# EAGLE design SDR-RPI Shield 3.0 (EAGLE 8.1.1)
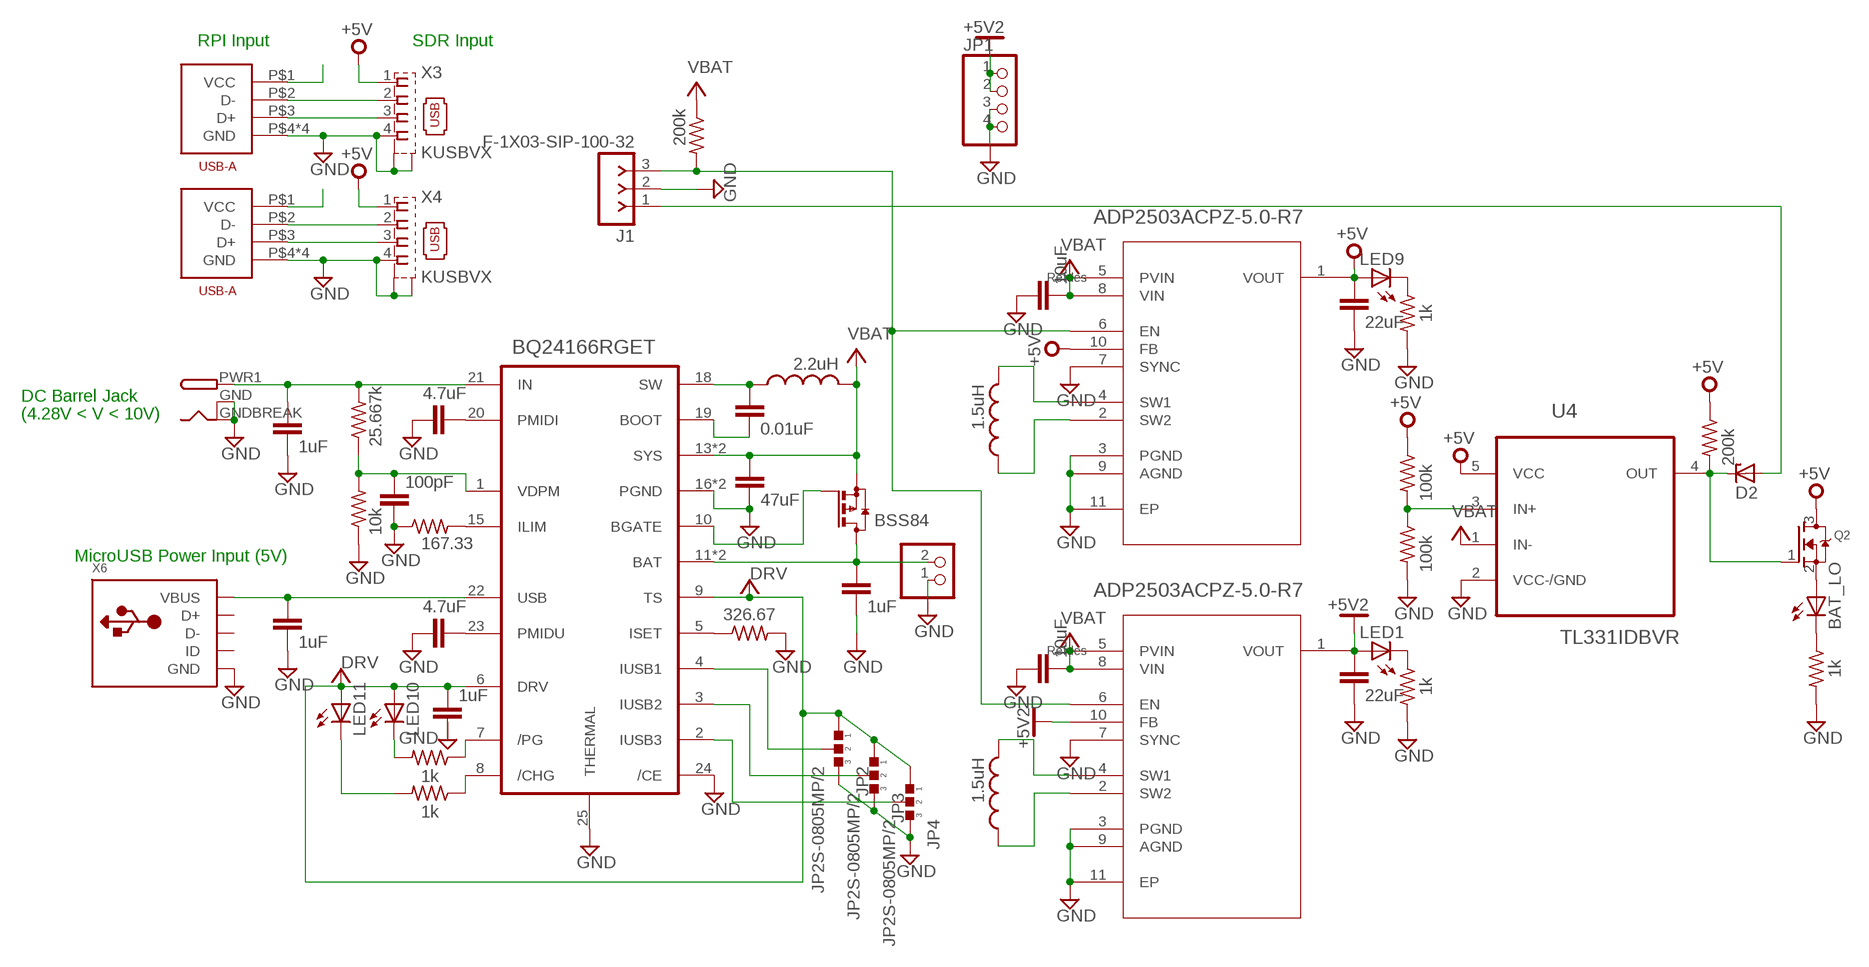
[diagram p0: schematic, sheet 1]

## Parts
BAT_LO  LED_ESML0603  [LED_SML0603]
C1  1uF  C-EUC0805  [C0805]
C2  4.7uF  C-EUC0805  [C0805]
C3  1uF  C-EUC0805  [C0805]
C4  4.7uF  C-EUC0805  [C0805]
C5  1uF  C-EUC0805  [C0805]
C6  0.01uF  C-EUC0805  [C0805]
C7  22uF  C-EUC0805  [C0805]
C8  1uF  C-EUC0805  [C0805]
C9  47uF  C-EUC0805  [C0805]
C10  10uF  C-EUC0805  [C0805]
C11  10uF  C-EUC0805  [C0805]
C12  22uF  C-EUC0805  [C0805]
C17  100pF  C-EUC0805  [C0805]
CN1  JST_2PIN-SMT  [JST-PH-2-SMT]
CN3  DCBARRELSMT  [DCJACK_2MM_SMT]
D2  ZENER-DIODESOD80C  [SOD80C]
J1  F-1X03-SIP-100-32  [SIP-100-03-32]
JP1  PINHD-1X4  [1X04]
JP2  JP2S-0805MP/2  [R0805MP/2]
JP3  JP2S-0805MP/2  [R0805MP/2]
JP4  JP2S-0805MP/2  [R0805MP/2]
L1  2.2uH  L-USL1812  [L1812]
L2  1.5uH  L-USL1812  [L1812]
L3  1.5uH  L-USL1812  [L1812]
LED1  LED_ESML0603  [LED_SML0603]
LED9  LED_ESML0603  [LED_SML0603]
LED10  LED_ESML0603  [LED_SML0603]
LED11  LED_ESML0603  [LED_SML0603]
Q1  BSS84  [SOT23]
Q2  MOSFET-NREFLOW  [SOT23]
R1  25.667k  R-US_M0805  [M0805]
R2  10k  R-US_M0805  [M0805]
R3  167.33  R-US_M0805  [M0805]
R4  1k  R-US_M0805  [M0805]
R5  1k  R-US_M0805  [M0805]
R6  326.67  R-US_M0805  [M0805]
R7  1k  R-US_M0805  [M0805]
R8  1k  R-US_M0805  [M0805]
R9  100k  R-US_M0805  [M0805]
R10  100k  R-US_M0805  [M0805]
R11  200k  R-US_M0805  [M0805]
R12  1k  R-US_M0805  [M0805]
R16  200k  R-US_M0805  [M0805]
U1  BQ24166RGET  [QFN50P400X400X100-25N]
U2  ADP2503ACPZ-5.0-R7  [DFN300X300X80-11N]
U3  ADP2503ACPZ-5.0-R7  [DFN300X300X80-11N]
U4  TL331IDBVR  [SOT95P280X145-5N]
U$1  USB-A  [USB-A]
U$2  USB-A  [USB-A]
X3  KUSBVX  [KUSBVX]
X4  KUSBVX  [KUSBVX]
X6  USB_MICRO_20329_V2  [4UCONN_20329_V2]

## Nets
+5V: C12.1 LED9.A Q2.3(D) R9.1 R11.1 U3.1(VOUT) U3.10(FB) U4.5(VCC) X3.1 X4.1
+5V2: C7.1 JP1.1 JP1.2 LED1.A U2.1(VOUT) U2.10(FB)
DRV: C5.1 JP2.1 JP3.1 JP4.1 LED10.A LED11.A U1.6(DRV) U1.9(TS)
GND: C1.2 C2.2 C3.2 C4.2 C5.2 C7.2 C8.2 C9.2 C10.1 C11.1 C12.2 C17.2 CN1.1 CN3.GND(GNDBREAK) CN3.GNDBREAK(GND) J1.2 JP1.3 JP1.4 JP2.3 JP3.3 JP4.3 R2.1 R3.1 R6.2 R7.2 R8.2 R10.2 R12.2 U1.16(PGND) U1.17(PGND) U1.24(/CE) U1.25(THERMAL) U2.3(PGND) U2.7(SYNC) U2.9(AGND) U2.11(EP) U3.3(PGND) U3.7(SYNC) U3.9(AGND) U3.11(EP) U4.2(VCC-/GND) U$1.P$4(GND) U$1.P$5(GND) U$1.P$6(GND) U$1.P$8(GND) U$2.P$4(GND) U$2.P$5(GND) U$2.P$6(GND) U$2.P$8(GND) X3.4 X3.M1(S1) X3.M2(S2) X4.4 X4.M1(S1) X4.M2(S2) X6.BASE@1(GND) X6.BASE@2(GND) X6.GND X6.SPRT@1(GND) X6.SPRT@2(GND) X6.SPRT@3(GND) X6.SPRT@4(GND)
N$1: C17.1 R1.1 R2.2 U1.1(VDPM)
N$2: R4.1 U1.7(/PG)
N$3: R5.1 U1.8(/CHG)
N$4: C1.1 CN3.PWR1(PWR) R1.2 U1.21(IN)
N$5: C2.1 U1.20(PMIDI)
N$6: R3.2 U1.15(ILIM)
N$7: C3.1 U1.22(USB) X6.VBUS
N$8: C4.1 U1.23(PMIDU)
N$9: Q1.1(G) U1.10(BGATE)
N$10: LED10.C R4.2
N$11: C6.2 U1.19(BOOT)
N$12: LED11.C R5.2
N$13: C6.1 L1.1 U1.18(SW)
N$14: J1.3 R16.2 U2.6(EN) U3.6(EN)
N$15: L2.2 U3.4(SW1)
N$16: L2.1 U3.2(SW2)
N$17: C8.1 CN1.2 Q1.3(D) U1.11(BAT) U1.12(BAT)
N$18: R6.1 U1.5(ISET)
N$19: R9.2 R10.1 U4.3(IN+)
N$20: LED1.C R7.1
N$21: L3.2 U2.4(SW1)
N$22: LED9.C R8.1
N$23: D2.A J1.1
N$24: L3.1 U2.2(SW2)
N$25: BAT_LO.A Q2.2(S)
N$26: D2.C Q2.1(G) R11.2 U4.4(OUT)
N$27: BAT_LO.C R12.1
N$32: U$1.P$2(D-) X3.2
N$33: U$1.P$3(D+) X3.3
N$34: U$2.P$2(D-) X4.2
N$35: U$2.P$3(D+) X4.3
N$40: JP2.2 U1.4(IUSB1)
N$41: JP3.2 U1.3(IUSB2)
N$42: JP4.2 U1.2(IUSB3)
N$43: U$1.P$1(VCC)
N$44: U$2.P$1(VCC)
V+: C9.1 C10.2 C11.2 L1.2 Q1.2(S) R16.1 U1.13(SYS) U1.14(SYS) U2.5(PVIN) U2.8(VIN) U3.5(PVIN) U3.8(VIN) U4.1(IN-) ; supply symbol labelled VBAT
Unconnected: X6.D+ X6.D- X6.ID

## Notes on the sheet
- RPI Input | SDR Input
- DC Barrel Jack
- (4.28V < V < 10V)
- MicroUSB Power Input (5V)

## Library data of the parts
BAT_LO LED1 LED9-LED11 = eagle-ltspice:LED_E: LED Source: http://www.osram.convergy.de Source: www.luxeon.com Source: www.kingbright.com; SPICEMODEL: NONE; SPICEPREFIX: D; SPICETYPE: diode
C1-C12 C17 = rcl:C-EU: CAPACITOR, European symbol
CN1 = adafruit:JST_2PIN: JST 2-Pin Connectors of various flavors SMT-RA (S2B-PH-SM4) 4UConnector #17311 SMT (B2B-PH-SM4) THM-RA (S2B-PH) THM (B2B-PH)
CN3 = adafruit:DCBARREL: 2.0mm DC Barrel Jack DCJACK_2MM_PTH - Through Hole Jack (4UConnector: 05537)
D2 = diode:ZENER-DIODE: Z-Diode
J1 = con-headers-jp:F-1X03-: FEMALE HEADER
JP1 = pinhead:PINHD-1X4: PIN HEADER
JP2-JP4 = jumpers:JP2S-: SMD Jumper/Bridge Two way package, zero ohm jumper
L1-L3 = resistor:L-US: INDUCTOR, American symbol
Q1 = transistor-small-signal:BSS84: P-CHANNEL MOS FET
Q2 = adafruit:MOSFET-N: N-Channel Mosfet 2N7002E - 60V 260mA SOT23 [Digikey: 2N7002ET1GOSTR-ND] - REEL BSH103 - 30V 850mA SOT23 [Digikey: 568-5013-1-ND]
R1-R12 R16 = rcl:R-US_: RESISTOR, American symbol
U1 = Texas Instruments_By_element14_Batch_1_EDIT:BQ24166RGET: Li-Polymer Battery Charger; MPN: BQ24166RGET; PACKAGE: VQFN-24; SUPPLIER: Texas Instruments
U2 U3 = Analog Devices_By_element14_Batch_1:ADP2503ACPZ-5.0-R7: DC-to-DC Converter; MPN: ADP2503ACPZ-5.0-R7; OC_FARNELL: -; OC_NEWARK: 11R0638; PACKAGE: LFCSP-10; SUPPLIER: Analog Devices
U4 = Texas Instruments_By_element14_Batch_1:TL331IDBVR: Single differential Comparator; MPN: TL331IDBVR; OC_FARNELL: -; OC_NEWARK: 76C9226; PACKAGE: SOT-23-5; SUPPLIER: Texas Instruments
U$1 U$2 = USB-A_thru-board:USB-A
X3 X4 = con-kycon:KUSBVX: Vertical,Top Entry Universal Serial Bus Connector KUSBVX Series Source: KYCON Sibalco USB vertical socket KUSBV.pdf
X6 = microbuilder:USB: USB Connectors USBMINIB - Surface Mount Female Mini-B USB Connector 4UConnector: 06564

## Board
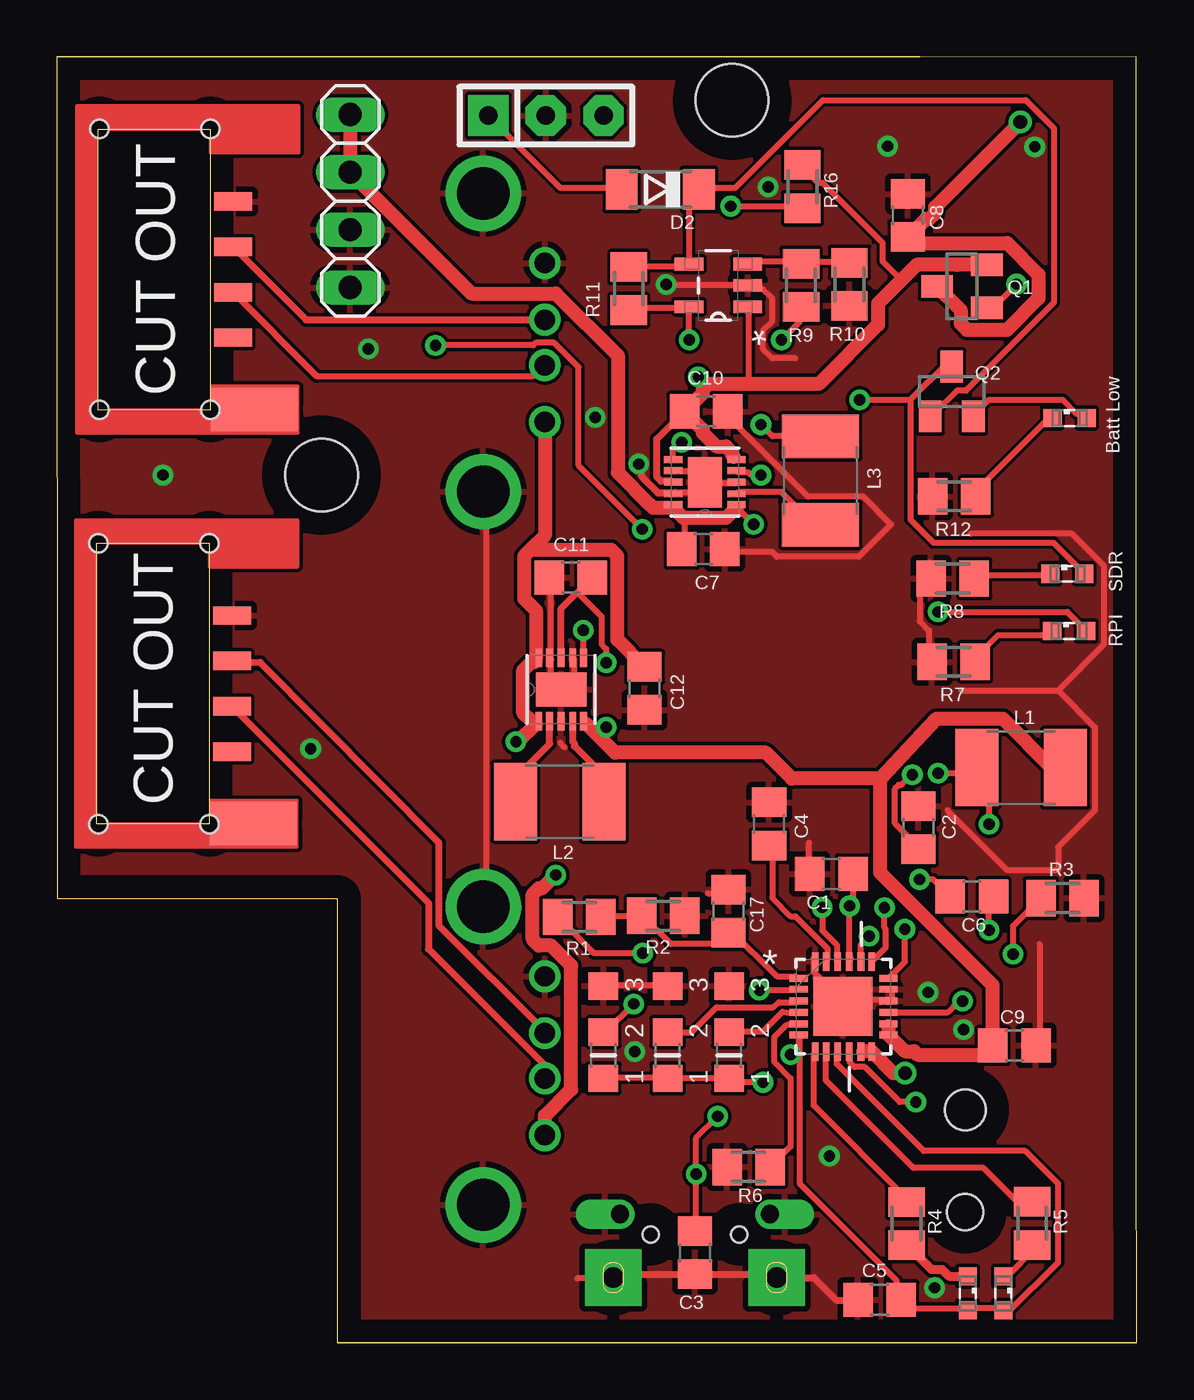
[diagram p1: board, top side]
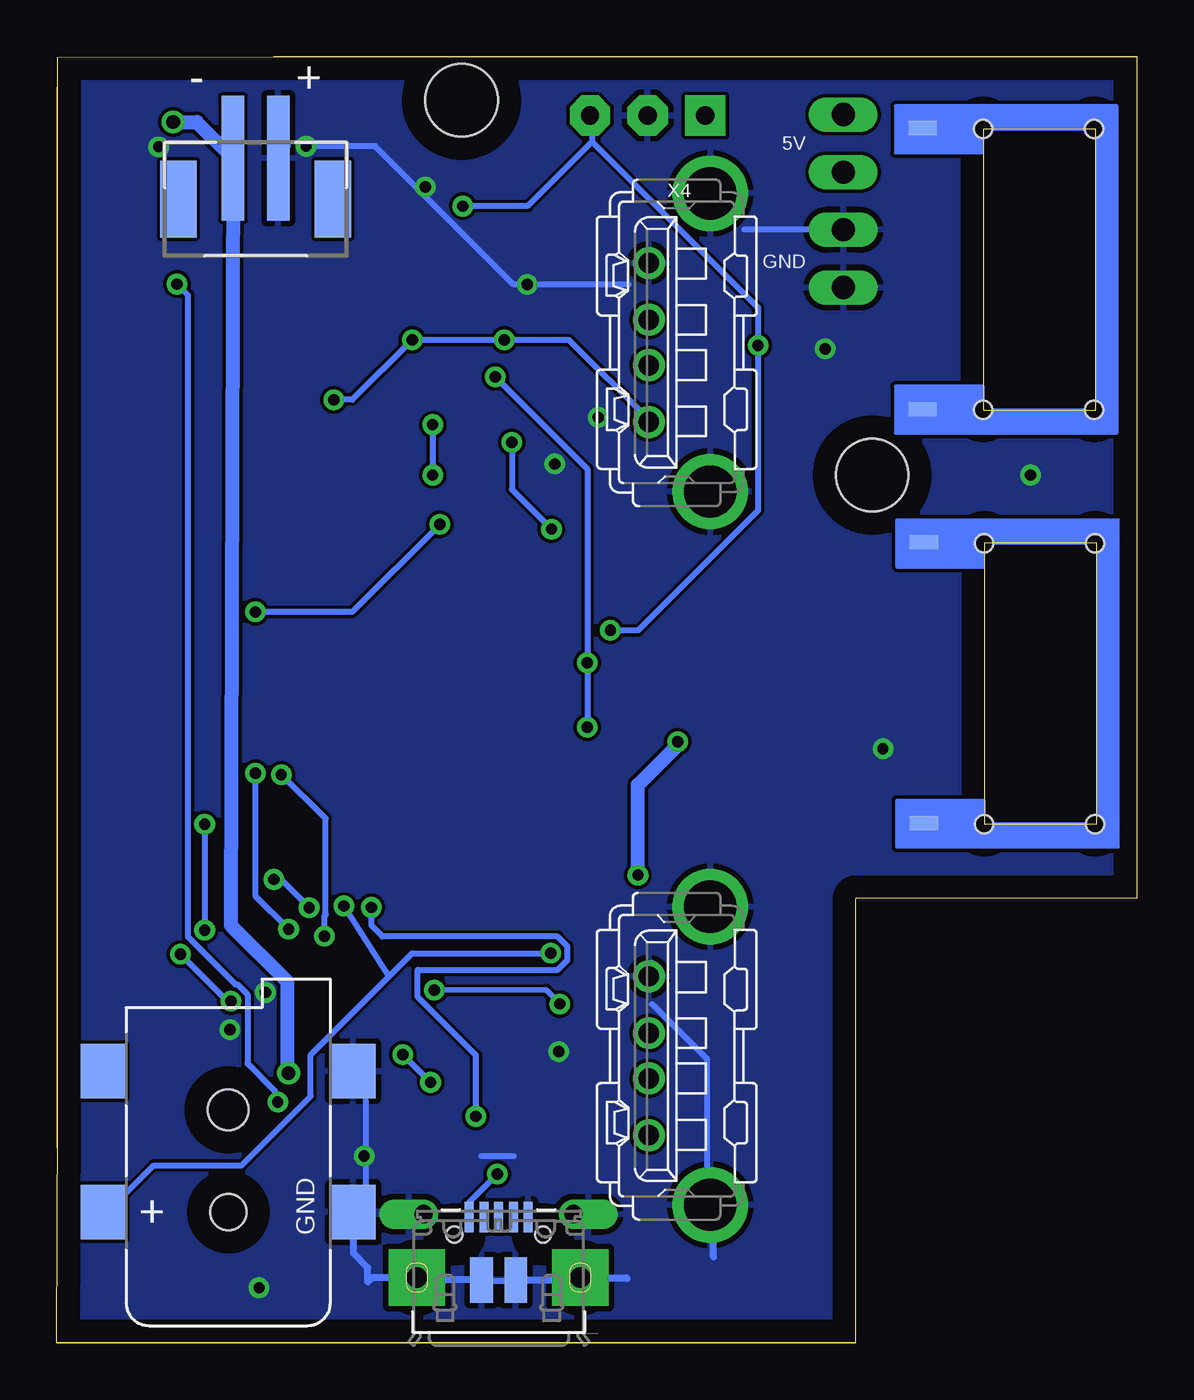
[diagram p2: board, bottom side, seen from below]

Size 47.59 x 56.67 mm. Coordinates in mm from the lower left corner, seen from the top.
Outline: 47.59,0 12.38,0
Outline: 12.38,0 12.38,19.59
Outline: 38.03,56.67 0,56.66 0.01,19.59 12.38,19.59
Outline: 12.38,0 47.59,0
Outline: 47.59,0 47.56,9.92 47.56,56.65 38.04,56.66 0.01,56.66
Outline: 47.56,8.6 47.56,55.33
Copper layers (1*16): Top 0.035mm / dielectric 1.5mm / Bottom 0.035mm
Design rules "default *": minimum track width 10mil, minimum drill 24mil, track to track 6mil, track to pad 6mil, pad to pad 6mil, via to via 6mil, smd to smd 6mil, copper to edge 40mil, drill to drill 8mil, minimum pad ring 10mil, minimum via ring 8mil, stop-mask expansion 4mil, vias tented up to drill 0mil, thermal gap 10mil
Holes 3.2 mm at 11.66,38.23 29.76,54.74

### Footprints (pad centres in the part's own frame; a part is rotated, then mirrored left to right if it is on the bottom)
LED_SML0603 = smd 0.8 x 0.8: A 0.75,0; C -0.75,0
C0805 = smd 1.3 x 1.5: 1 -0.95,0; 2 0.95,0
JST-PH-2-SMT = smd 1 x 5.5: 1 -1,-1.8; 2 1,-1.8 | smd 1.6 x 3.4: NC1 -3.4,0; NC2 3.4,0
DCJACK_2MM_SMT = smd 2.4 x 2: GND 0,-5.5; GNDBREAK 6.2,-5.5; PWR1 0,5.5; PWR2 6.2,5.5 | hole 1.6: 0,0 | hole 1.8: 4.5,0
SOD80C = smd 1.4 x 1.8: A 1.7,0; C -1.7,0
SIP-100-03-32 = drill 0.813 pad 1.778 square: 1 -2.54,0 | drill 0.813 pad 1.778 octagon: 2 0,0; 3 2.54,0
1X04 = drill 1.016 long: 1 -3.81,0; 2 -1.27,0; 3 1.27,0; 4 3.81,0
R0805MP/2 = smd 1.2 x 1.3: 1 -2.032,0; 2 0,0; 3 2.032,0
L1812 = smd 1.9 x 3.4: 1 -1.95,0; 2 1.95,0
SOT23 = smd 1 x 1.4: 1 -0.95,-1.1; 2 0.95,-1.1; 3 0,1.1
M0805 = smd 1.3 x 1.6: 1 -0.95,0; 2 0.95,0
QFN50P400X400X100-25N = smd 0.813 x 0.305: 1 -1.981,1.245; 2 -1.981,0.762; 3 -1.981,0.254; 4 -1.981,-0.254; 5 -1.981,-0.762; 6 -1.981,-1.245; 13 1.981,-1.245; 14 1.981,-0.762; 15 1.981,-0.254; 16 1.981,0.254; 17 1.981,0.762; 18 1.981,1.245 | smd 0.305 x 0.813: 7 -1.245,-1.981; 8 -0.762,-1.981; 9 -0.254,-1.981; 10 0.254,-1.981; 11 0.762,-1.981; 12 1.245,-1.981; 19 1.245,1.981; 20 0.762,1.981; 21 0.254,1.981; 22 -0.254,1.981; 23 -0.762,1.981; 24 -1.245,1.981 | smd 2.591 x 2.591: 25 -0.025,0
DFN300X300X80-11N = smd 0.813 x 0.305: 1 -1.397,0.991; 2 -1.397,0.508; 3 -1.397,0; 4 -1.397,-0.508; 5 -1.397,-0.991; 6 1.397,-0.991; 7 1.397,-0.508; 8 1.397,0; 9 1.397,0.508; 10 1.397,0.991 | smd 1.499 x 2.235: 11 0,0
SOT95P280X145-5N = smd 1.27 x 0.559: 1 -1.295,0.94; 2 -1.295,0; 3 -1.295,-0.94; 4 1.295,-0.94; 5 1.295,0.94
USB-A = smd 0.813 x 1.676: P$1 3,-1.19; P$2 5,-1.19; P$3 7,-1.19; P$4 9,-1.19 | smd 1.93 x 3.81: P$5 -0.159,-2.127 | smd 0.635 x 1.27 bottom: P$6 -0.159,-2.86; P$8 12.234,-2.86 | hole 0.8: -0.191,4.691; 12.191,4.691; 12.191,-0.191; -0.191,-0.191
KUSBVX = drill 0.9 pad 1.3: 1 3.5,0; 2 1,0; 3 -1,0; 4 -3.5,0 | drill 2.3 pad 2.8: M1 -6.57,2.71; M2 6.57,2.71
4UCONN_20329_V2 = smd 1 x 2: BASE@1 -0.75,-2; BASE@2 0.75,-2 | smd 0.4 x 1.35: D+ 0,0.775; D- -0.65,0.775; GND 1.3,0.775; ID 0.65,0.775; VBUS -1.3,0.775 | drill 0.8 pad 1.2 offset: SPRT@1 -3.3,0.9; SPRT@2 3.3,0.9 | drill 0.9 pad 2.5 square: SPRT@3 -3.6,-1.9; SPRT@4 3.6,-1.9 | hole 0.7: -1.95,0; 1.95,0

### Placement (x,y rotation side)
BAT_LO  44.63,40.75 0 top
C1  34.13,20.66 180 top
C2  37.97,22.7 90 top
C3  28.13,3.97 270 top
C4  31.39,22.86 90 top
C5  36.26,1.9 180 top
C6  40.33,19.66 180 top
C7  28.49,34.97 0 top
C8  37.5,49.67 90 top
C9  42.2,13.09 0 top
C10  28.62,41.04 180 top
C11  22.65,33.72 0 top
C12  25.9,28.83 270 top
C17  29.61,19.02 90 top
CN1  38.83,50.39 180 bottom
CN3  40.04,5.76 90 bottom
D2  26.6,50.82 180 top
J1  21.56,54.07 0 top
JP1  12.93,50.31 270 top
JP2  29.62,13.68 90 top
JP3  26.92,13.68 90 top
JP4  24.08,13.68 90 top
L1  42.49,25.34 0 top
L2  22.16,23.84 0 top
L3  33.65,37.99 90 top
LED1  44.61,31.36 0 top
LED9  44.52,33.88 0 top
LED10  40.14,2.18 270 top
LED11  41.72,2.18 270 top
Q1  39.89,46.55 90 top
Q2  39.44,41.92 0 top
R1  23.03,18.76 180 top
R2  26.73,18.81 180 top
R3  44.32,19.6 180 top
R4  37.44,5.26 270 top
R5  42.98,5.26 270 top
R6  30.48,7.75 180 top
R7  39.51,30 180 top
R8  39.48,33.67 180 top
R9  32.8,46.59 90 top
R10  34.93,46.64 270 top
R11  25.2,46.45 90 top
R12  39.54,37.29 180 top
R16  32.86,50.94 270 top
U1  34.66,14.82 0 top
U2  28.55,37.92 180 top
U3  22.23,28.78 90 top
U4  29.15,46.59 180 top
U$1  6.53,23.04 90 top
U$2  6.58,41.29 90 top
X3  21.51,12.64 270 bottom
X4  21.51,44.07 270 bottom
X6  28.12,4.77 0 bottom

### Tracks (layer width: path | path; a pad name or v marks a point on that pad's centre or on a via)
+5V  (via drill 0.5)
  Top 0.254: 37.62,41.55 37.62,36.26 38.64,35.25 43.92,35.25 45.14,34.03 LED9.A | 37.62,41.55 39.25,43.17 Q2.3 | R11.1 25.23,45.61 27.67,45.61 U4.5 27.87,45.61 v27.87,44.19 | 21.11,27.26 21.16,27.53 | 21.11,27.12 20.96,27.12 20.92,27.39 21.16,27.53 | 20.92,29.99 20.96,29.97 21.11,30.18 21.16,30.17 U3.10 | v31.93,44.19 32.75,45 32.75,45.61 R9.1 | v35.39,41.55 37.62,41.55 | 21.16,27.53 U3.1
  Top 0.61: X3.1 21.51,10 22.67,11.16 22.67,16.62 21.79,17.51 21.24,17.51 20.97,17.77 20.97,19.75 21.24,20.02 21.39,20.02 v21.98,20.61 | 20.86,34.93 20.59,34.66 20.59,32.79 21.11,32.26 21.11,30.18 | 20.86,34.93 24.44,34.93 24.71,34.66 24.71,30.98 C12.1 | X4.1 21.51,35.58 20.86,34.93 | 20.92,27.39 20.55,27.76 20.55,29.62 20.92,29.99 21.05,29.99 21.11,30.05 | v20.24,26.49 20.34,26.49 21.11,27.26
  Bottom 0.254: X4.1 21.57,40.73 25.02,44.19 v27.87,44.19 v31.93,44.19 34.57,41.55 v35.39,41.55
  Bottom 0.61: v21.98,20.61 21.98,24.58 20.24,26.33 v20.24,26.49
+5V2  (via drill 0.5)
  Top 0.254: v38.84,32.2 44.53,32.2 45.34,31.39 LED1.A | v30.71,36.06 30.1,36.67 29.95,36.8 30.1,36.87 U2.1 | C7.1 27.67,35.05 27.67,36.06 27.62,36.34 | 26.9,36.8 26.9,36.65 27.16,36.8 27.26,36.87 27.21,36.92 U2.10
  Top 0.61: JP1.1 JP1.2 18.28,46.24 21.99,46.24 24.73,43.5 24.73,38.35 26.15,36.92 26.16,36.92 26.28,36.8 26.9,36.8 27.16,36.8 | 29.95,36.8 29.49,36.34 27.62,36.34 27.16,36.8
  Bottom 0.254: v38.84,32.2 34.57,32.2 v30.71,36.06
DRV  (via drill 0.5)
  Top 0.254: U1.9 34.37,12.69 34.37,12.29 38.21,8.45 42.68,8.45 44.12,7 44.12,3.55 41.89,1.31 LED11.A 41.69,1.52 40.26,1.52 LED10.A 40.06,1.52 37.42,1.52 37.22,1.72 C5.1 37.01,1.92 37.01,2.74 32.75,7 32.75,12.69 | JP4.1 24.21,11.68 26.85,11.68 JP3.1 27.06,11.68 29.49,11.68 JP2.1 29.7,11.47 v31.12,11.47 | 32.75,12.69 32.75,13.51 U1.6 | 32.75,12.69 v32.34,12.69
  Bottom 0.254: v32.34,12.69 v31.12,11.47
GND  (via drill 0.5)
  Top 0.254: U1.17 36.81,15.54 36.81,15.13 U1.16 36.61,15.13 34.57,15.13 | 34.57,15.13 34.78,14.93 U1.25 34.57,15.13 | 34.57,15.13 33.36,16.35 33.36,16.76 U1.24 33.36,16.96 | 28.68,19.81 29.49,19.81 C17.2 | 27.87,18.99 R2.1 27.67,18.99 | 33.15,22.04 33.15,20.01 C1.2 | 31.53,23.67 C4.2 31.32,23.67 | 29.7,20.01 C17.2 | 29.7,19.81 C17.2 | 43.31,17.57 43.31,13.1 C9.2 | 45.14,19.4 R3.1 45.34,19.6 | 39.25,23.46 41.89,20.82 44.12,20.82 44.12,21.84 45.75,23.46 45.75,27.12 44.12,28.75 | 38.03,23.46 C2.2 | U3.11 22.18,28.75 | U3.11 22.18,28.95 21.77,29.36 21.77,30.17 U3.9 21.77,30.37 21.77,33.62 C11.1 | 22.79,29.36 22.79,30.17 U3.7 | 22.38,28.95 U3.11 | 25.84,27.93 C12.2 26.04,27.93 | 29.29,34.84 C7.2 29.49,34.84 31.53,34.84 31.73,34.64 35.34,34.64 36.77,36.06 35.55,37.28 33.11,37.28 29.86,40.53 29.7,40.94 C10.1 | 38.44,34.39 38.44,33.83 R8.2 38.44,33.62 38.03,33.22 38.03,31.79 38.44,31.39 38.44,30.17 R7.2 38.64,29.97 | 40.26,35.65 44.73,35.65 46.16,34.23 46.16,30.78 44.12,28.75 | 39.86,28.75 44.12,28.75 | 38.64,37.28 R12.2 | 22.18,26.44 22.38,26.24 | JP4.3 24.21,15.74 26.85,15.74 JP3.3 27.06,15.74 | 29.49,15.74 JP2.3 | C5.2 35.18,1.92 | 31.53,5.58 X6.SPRT@1 31.53,5.78 | 29.7,7.61 R6.2 29.49,7.82 | 25.02,5.78 X6.SPRT@2 | 8.77,22.85 U$1.P$5 | 18.72,6.19 X3.M2 | 37.42,50.69 C8.2 | 13.04,46.63 JP1.4 | 13.04,48.86 JP1.3 12.83,49.07 | 7.96,50.29 U$2.P$4 | 32.54,43.38 31.53,43.38 31.12,43.78 31.12,44.6 31.53,45 31.53,46.02 31.12,46.42 30.51,46.42 U4.2 30.31,46.63 v26.85,46.63 | 34.78,45.61 R10.2 | 21.37,48.05 21.37,47.64 X4.4 | 18.93,50.49 X4.M1 | X3.M1 18.93,19.4 18.93,37.48 X4.M2 18.93,37.69 | U2.9 27.26,37.48 28.07,37.48 28.48,37.89 U2.11
  Top 0.254: U2.3 29.9,37.89 28.68,37.89 U2.11 | U2.7 27.18,38.4 27.29,38.4 27.29,38.39 28.01,38.39 28.49,37.92 U2.11 | 25.47,38.87 v25.65,38.72 | X6.SPRT@4 24.49,2.83 22.93,2.83
  Top 0.305: X6.SPRT@4 24.67,3.02 C3.2 31.57,3.02 X6.SPRT@3 33.38,2.87 34.36,1.88 35.29,1.88 C5.2 | 22.79,29.36 22.79,29.34 U3.11 | U2.9 27.11,37.46 26.49,37.46 25.79,38.15 v25.65,38.72
  Bottom 0.254: 21.37,16.76 21.37,16.15 X3.4 21.37,15.94 | 18.93,19.2 X3.M1 | 33.96,5.78 34.37,5.78 CN3.GND 33.96,5.78 | 31.53,5.78 X6.SPRT@1 31.32,5.78 | 33.96,5.78 33.96,10.66 | 34.37,11.88 CN3.GNDBREAK | 21.37,14.93 18.93,12.49 18.93,6.19 X3.M2 | 37.42,52.72 37.83,52.32 CN1.1 | 21.37,53.94 J1.2 | 18.93,50.69 X4.M1 18.72,50.49 | 22.38,46.63 v26.85,46.63 27.46,46.63 33.56,52.72 v36.61,52.72 | 21.57,47.44 X4.4 | 17.3,49.07 13.04,49.07 JP1.3 | 18.93,37.69 X4.M2 | X6.BASE@2 27.46,2.74 28.68,2.74 X6.BASE@1 | 27.46,8.22 28.88,8.22 | 25.02,5.78 X6.SPRT@2
  Bottom 0.305: X6.BASE@2 24.62,2.77 X6.SPRT@4 22.5,2.87 22.46,2.83 | X6.BASE@1 31.62,2.77 X6.SPRT@3 33.69,2.87 33.89,2.67 33.89,3.31 34.52,3.94 34.52,5.75 CN3.GND | 18.65,3.78 18.65,5.92 X3.M2
  other vias: 4.68,38.23 23.73,40.77 43.1,52.7 31.35,50.93 34.05,8.23 11.19,26.17 13.73,43.79 25.47,12.83 38.68,2.42 39.96,13.8 38.4,15.44
  pour Bottom: 0.07,56.65 48.18,56.65 48.18,-0.03 13.25,-0.03 13.25,19.18 -0.08,19.18
  pour Top: 0.07,56.65 48.18,56.65 48.18,-0.03 13.25,-0.03 13.25,19.18 -0.08,19.18
N$1
  Top 0.254: R1.1 24.01,18.79 25.63,18.79 R2.2 25.84,18.79 27.06,17.57 29.09,17.57 29.49,17.98 C17.1 29.7,18.18 31.73,16.15 32.54,16.15 U1.1
N$2
  Top 0.254: U1.7 33.36,12.69 33.36,10.46 37.42,6.39 R4.1
N$3
  Top 0.254: R5.1 42.33,6.21 40.84,7.7 37.75,7.7 33.89,11.56 33.89,12.82 U1.8
N$4  (via drill 0.5)
  Top 0.254: 34.98,16.96 U1.21 34.92,18.91 v34.94,19.25 35.08,19.42 C1.1 | v25.82,17.16 23.68,17.16 22.3,18.55 22.18,18.59 R1.2
  Bottom 0.254: v25.82,17.16 31.93,17.16 32.95,16.15 | 32.95,16.15 36.4,12.69 36.4,10.86 39.45,7.82 43.31,7.82 45.34,5.78 CN3.PWR1 | 32.95,16.15 v34.94,19.25
N$5  (via drill 0.5)
  Top 0.254: C2.1 37.97,21.86 36.94,22.88 36.94,24.42 37.1,24.58 37.22,24.58 v37.7,25.03 | U1.20 35.43,17.55 v35.79,17.91
  Bottom 0.254: v35.79,17.91 35.79,18.82 35.74,18.87 35.74,23.1 v37.7,25.03
N$6  (via drill 0.5)
  Top 0.254: U1.15 39.27,14.56 39.76,15.06 v39.92,15.06 | v42.14,17.12 42.14,18.37 R3.2
  Bottom 0.254: v39.92,15.06 40.08,15.06 v42.14,17.12
N$7  (via drill 0.5)
  Top 0.254: C3.1 28.17,4.96 v28.17,7.44 28.17,9.02 v29.13,9.98 | v33.73,19.18 33.73,18.18 34.37,17.54 34.37,17.05 34.4,16.97 34.37,16.89 34.37,16.84 U1.22
  Bottom 0.254: 29.44,5.53 X6.VBUS 29.42,6.19 v28.17,7.44 | v29.13,9.98 29.13,12.67 31.69,15.23 31.69,16.43 25.52,16.43 25.09,16.86 25.09,17.47 25.52,17.9 33.24,17.9 33.73,18.39 v33.73,19.18
N$8
  Top 0.254: U1.23 33.96,16.96 33.96,17.37 32.54,18.79 32.34,18.79 31.53,19.6 31.53,21.84 C4.1
N$9  (via drill 0.5)
  Top 0.254: 42.1,46.45 v42.3,46.65 41.25,45.6 Q1.1 | v37.86,10.61 37.14,10.61 35.6,12.15 35.16,12.15 34.94,12.37 34.94,12.81 U1.10
  Bottom 0.254: v37.86,10.61 37.99,10.75 37.99,11.11 39.19,12.3 39.19,15.36 39.62,15.79 39.72,15.79 41.81,17.88 41.81,46.15 v42.3,46.65
N$10
  Top 0.254: LED10.C 40.06,2.94 | R4.2 37.62,4.16
  Top 0.406: 37.62,4.16 38.55,3.23 39.01,3.23 39.31,2.93 LED10.C
N$11  (via drill 0.5)
  Top 0.254: v38.03,20.41 38.64,20.41 39.25,19.81 C6.2 | 36,16.96 U1.19 36.53,17.42 36.53,18.22 36.47,18.27 v36.47,19.18
  Bottom 0.254: v38.03,20.41 37.71,20.41 v36.47,19.18
N$12
  Top 0.254: LED11.C 41.89,2.94 43.11,4.16 R5.2
N$13  (via drill 0.5)
  Top 0.254: 37.29,18.14 v37.37,18.22 37.37,16.79 U1.18 | v38.84,25.09 40.26,25.09 40.47,25.29 L1.1 40.67,25.29 41.08,24.89 v41.08,22.85 | v41.08,18.18 41.08,19.6 C6.1
  Bottom 0.254: v37.37,18.22 38.84,19.69 v38.84,25.09 | v41.08,22.85 v41.08,18.18
N$14  (via drill 0.5)
  Top 0.254: v23.2,31.39 23.2,30.37 U3.6 | v29.7,50.08 32.75,50.08 R16.2 | U2.6 27.16,39.44 v27.54,39.68 | v25.79,35.85 22.99,38.65 22.99,42.98 21.91,44.06 21.1,44.06 20.99,43.95 v16.69,43.95
  Bottom 0.254: v23.2,31.39 21.98,31.39 16.69,36.67 v16.69,43.95 16.69,45.61 24.01,52.93 | 24.01,52.93 24.01,53.94 J1.3 | v29.7,50.08 26.85,50.08 24.01,52.93 | v27.54,39.68 27.54,37.6 v25.79,35.85
N$15
  Top 0.305: U3.4 22.74,26.49 22.81,26.42 22.81,26.29 23.89,25.22 23.89,24.07 L2.2
N$16
  Top 0.305: U3.2 21.72,26.38 20.39,25.06 20.39,24.02 L2.1
N$17  (via drill 0.6)
  Top 0.254: U1.11 35.39,12.9 35.53,12.84
  Top 0.61: v37.38,11.88 36.87,11.88 U1.12 35.53,12.84 | Q1.3 39.83,45.5 39.83,44.91 40.1,44.64 41.88,44.64 43.26,46.02 43.26,47.07 41.88,48.45 37.77,48.45 C8.1 38.29,49.51 38.44,49.51 38.71,49.78 38.71,50.04 v42.46,53.79
  Bottom 0.61: v37.38,11.88 37.45,11.95 37.45,15.92 39.92,18.39 CN1.2 41.43,53.79 v42.46,53.79
N$18
  Top 0.254: R6.1 32.34,8.65 32.34,11.66 31.61,12.39 31.61,13.45 32.16,14 32.63,14 U1.5
N$19
  Top 0.254: U4.3 30.51,47.64 32.75,47.64 R9.2 32.95,47.64 34.78,47.64 R10.1
N$20
  Top 0.254: LED1.C 43.72,31.18 41.48,31.18 40.47,30.17 R7.1
N$21  (via drill 0.5)
  Top 0.254: L3.2 31.54,39.94 v31.03,40.46 | v31.03,38.23 30.59,38.23 30.47,38.35 30.03,38.35 U2.4
  Bottom 0.254: v31.03,40.46 v31.03,38.23
N$22
  Top 0.254: LED9.C 43.72,33.83 40.47,33.83 R8.1
N$23
  Top 0.254: D2.A 24.82,50.89 22.18,50.89 19.13,53.94 J1.1
N$24
  Top 0.254: U2.2 30.1,37.48 31.93,37.48 33.36,36.06 L3.1
N$25
  Top 0.254: BAT_LO.A 45.34,40.94 44.94,40.94 44.33,41.55 41.08,41.55 40.47,40.94 Q2.2
N$26
  Top 0.254: R11.2 25.23,47.44 27.67,47.44 U4.4 27.87,47.64 27.87,50.29 28.28,50.69 D2.C 28.48,50.89 29.9,50.89 33.76,54.76 42.7,54.76 43.95,53.51 43.95,45.84 40.06,41.95 39.65,41.95 38.64,40.94 Q2.1
N$27
  Top 0.254: BAT_LO.C 43.72,40.73 40.47,37.48 R12.1
N$32
  Top 0.305: X3.2 21.51,12.22 16.38,17.35 16.38,19.39 U$1.P$2
N$33
  Top 0.305: X3.3 21.51,13.73 16.83,18.4 16.83,22.04 8.96,29.98 7.79,30.04 U$1.P$3
N$34
  Top 0.254: 11.46,42.6 21.03,42.6 X4.2
  Top 0.305: U$2.P$2 11.46,42.6
N$35
  Top 0.305: X4.3 10.98,45.07 U$2.P$3
N$40
  Top 0.254: U1.4 32.54,14.52 32.57,14.52 31.98,14.58 31.11,13.71 29.7,13.71 JP2.2
N$41
  Top 0.254: JP3.2 27.98,13.68 29.08,14.79 31.57,14.79 31.83,15 32.61,15 U1.3
N$42  (via drill 0.5)
  Top 0.254: v30.96,15.54 31.35,15.53 31.35,15.54 32.54,15.54 U1.2 | v25.43,14.93 24.21,13.71 JP4.2
  Bottom 0.254: v30.96,15.54 30.88,15.54 30.55,15.53 26.04,15.54 v25.43,14.93
V+  (via drill 0.5)
  Top 0.254: U1.14 U1.13 | U3.5 23.2,27.53 23.35,27.26 | v24.21,27.12 23.85,26.76 | v24.21,29.97 24.21,30.57 24.01,30.78 24.01,32 22.99,33.01 C11.2 | 30.51,42.25 30.51,45.61 U4.1 | 37.22,46.82 36.4,47.64 36.4,48.46 33.76,51.1 33.56,51.1 32.95,51.71 R16.1 | 28.66,42.18 v28.28,42.56
  Top 0.305: U3.8 22.23,32.36 C11.2 | U2.8 27.11,37.97 26.62,37.97 26.45,38.14 26.45,39.82 C10.2 | U2.5 29.95,39.03 29.76,39.22
  Top 0.61: 36.28,24.86 36.28,20.71 41.25,15.75 C9.1 41.18,13.09 40.77,12.69 37.93,12.69 37.78,12.84 37.38,12.84 U1.13 36.65,13.95 | 36.28,24.86 38.77,27.5 41.68,27.5 43.84,25.34 L1.2 | 36.28,24.86 32.39,24.86 31.25,26 24.61,26 23.85,26.76 23.35,27.26 | 29.82,39.03 29.76,39.1 29.76,39.22 29.49,39.49 29.07,39.49 28.46,40.1 28.46,40.25 C10.2 28.46,41.83 28.46,41.98 28.66,42.18 28.73,42.25 30.51,42.25 33.58,42.25 36.19,44.85 36.19,45.79 37.22,46.82 37.9,47.5 39.68,47.5 39.69,47.5 Q1.2
  Bottom 0.254: v24.21,27.12 v24.21,29.97 24.21,38.5 v28.28,42.56

### Text on the board
tNames: CUT OUT | Batt Low | SDR | RPI | CUT OUT
bNames: 5V | GND